# Altium schematic sheet Battery charger.SchDoc
size A4; SheetNumber: 3; SheetTotal: 4
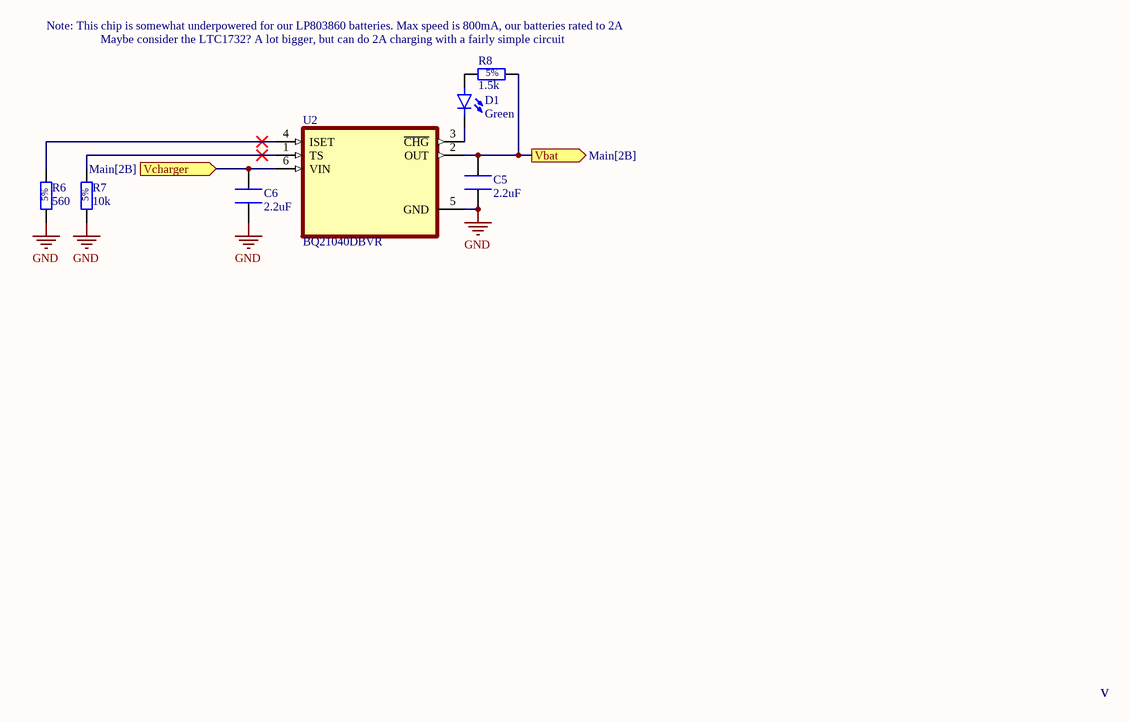
[diagram p0: Battery charger.SchDoc]

## Parts
C5  2.2uF  [CAPACITOR_0805_2012M-70N]
C6  2.2uF  [CAPACITOR_0805_2012M-70N]
D1  Colour: Green  [LED_0603_1608M_0.80mm]  (hidden comment: LTST-C190 Series)
R6  560  [Resistor_0805_2012M-50N]
R7  10k  [Resistor_0805_2012M-50N]
R8  1.5k  [Resistor_0805_2012M-50N]
U2  BQ21040DBVR  [SOT95P280X145-6N]

## Ports
Vbat (out, see Main[2B]), Vcharger (in, see Main[2B])

## Nets
GND: C5.2 C6.1 R6.1 R7.1 U2.5(GND)
Vbat: C5.1 R8.2 U2.2(OUT) ; port Vbat
Vcharger: C6.2 U2.6(VIN) ; port Vcharger
NetD1_A: D1.A R8.1
NetD1_C: D1.C U2.3(~{CHG})
NetR6_2: R6.2 U2.4(ISET)
NetR7_2: R7.2 U2.1(TS)

## Notes on the sheet
- Note: This chip is somewhat underpowered for our LP803860 batteries. Max speed is 800mA, our batteries rated to 2A
- Maybe consider the LTC1732? A lot bigger, but can do 2A charging with a fairly simple circuit
- v

## Library data of the parts
C5 C6 = C0805C225K8PACTU: Passive - Capacitor, X5R, 2.2uF Max, 10V, 0805 (2012 Metric), ±10%, -55°C ~ 85°C. 2uF @ 5V, 1.1uF @ 10V; APSS Standard Part: APSS Standard; Capacitance at Rated Voltage: 50%; Tolerance: ±10%; Temperature Coefficient: X5R; Rated Voltage: 10V; Temp Range: -55°C ~ 85°C; Package: 0805; Supplier 1: Digikey; Supplier 1 Part No.: 399-C0805C225K8PAC7800-ND; MF Part No.: C0805C225K8PACTU; Value: 2.2uF
D1 = LTST-C190 Series: Diode - LED, 0603; MF Part No.: LTST-C190KGKT; APSS Standard Part: APSS Standard; Temp Range: -30°C ~ 85°C; Rated Voltage: 5V Reverse; Package: 0603; Supplier 1: Digikey; Supplier 1 Part No.: 160-1435-1-ND
R6 = RMCF0805JT Series: Passive - Resistor Series, 0805, 5%, 100m - 22M, E24, 0.063W, 1/16W, ±200ppm/°C, -55°C ~ 155°C, 0805 (2012 Metric); MF Part No.: RMCF0805JT560R; APSS Standard Part: APSS Standard; Power: 1/8W; Value Range: 100m ~ 22M; Rated Voltage: 150V; Tolerance: 5%; E Series: E24; Temp Range: -55°C ~ 155°C; Supplier 1: Digikey; Package: 0805; Temperature Coefficient: ±200ppm/°C; Value: 560
R7 = RMCF0805JT Series: Passive - Resistor Series, 0805, 5%, 100m - 22M, E24, 0.063W, 1/16W, ±200ppm/°C, -55°C ~ 155°C, 0805 (2012 Metric); MF Part No.: RMCF0805JT10K0; APSS Standard Part: APSS Standard; Power: 1/8W; Value Range: 100m ~ 22M; Rated Voltage: 150V; Tolerance: 5%; E Series: E24; Temp Range: -55°C ~ 155°C; Supplier 1: Digikey; Package: 0805; Temperature Coefficient: ±200ppm/°C; Value: 10k
R8 = RMCF0805JT Series: Passive - Resistor Series, 0805, 5%, 100m - 22M, E24, 0.063W, 1/16W, ±200ppm/°C, -55°C ~ 155°C, 0805 (2012 Metric); MF Part No.: RMCF0805JT1K50; APSS Standard Part: APSS Standard; Power: 1/8W; Value Range: 100m ~ 22M; Rated Voltage: 150V; Tolerance: 5%; E Series: E24; Temp Range: -55°C ~ 155°C; Supplier 1: Digikey; Package: 0805; Temperature Coefficient: ±200ppm/°C; Value: 1.5k
U2 = BQ21040DBVR: 1-cell, 0.8-A Li-ion and Li-polymer battery charger; MF: Texas Instruments; Package: SOT23-6; MF Part No.: BQ21040DBVR; Value: *; Supplier 1 Part No.: 296-47315-1-ND; Supplier 1: Digikey